# Altium schematic sheet BRAINS.SchDoc: Top Level
size A3; CompanyName: NOT USED; SheetNumber: 0; SheetTotal: 0; PageSetup: Record=PageOptions|CenterHorizontal=True|CenterVertical=True|PrintScale=1.00|XCorrection=1.00|YCorrection=1.00|PrintKind=0|BorderSize=5000000|LeftOffset=0|BottomOffset=0|Orientation=2|PaperLength=1000|PaperWidth=1000|Scale=100|PaperSource=7|PrintQuality=-4|MediaType=1|DitherType=10|PaperKind=A3|PrintScaleMode=0
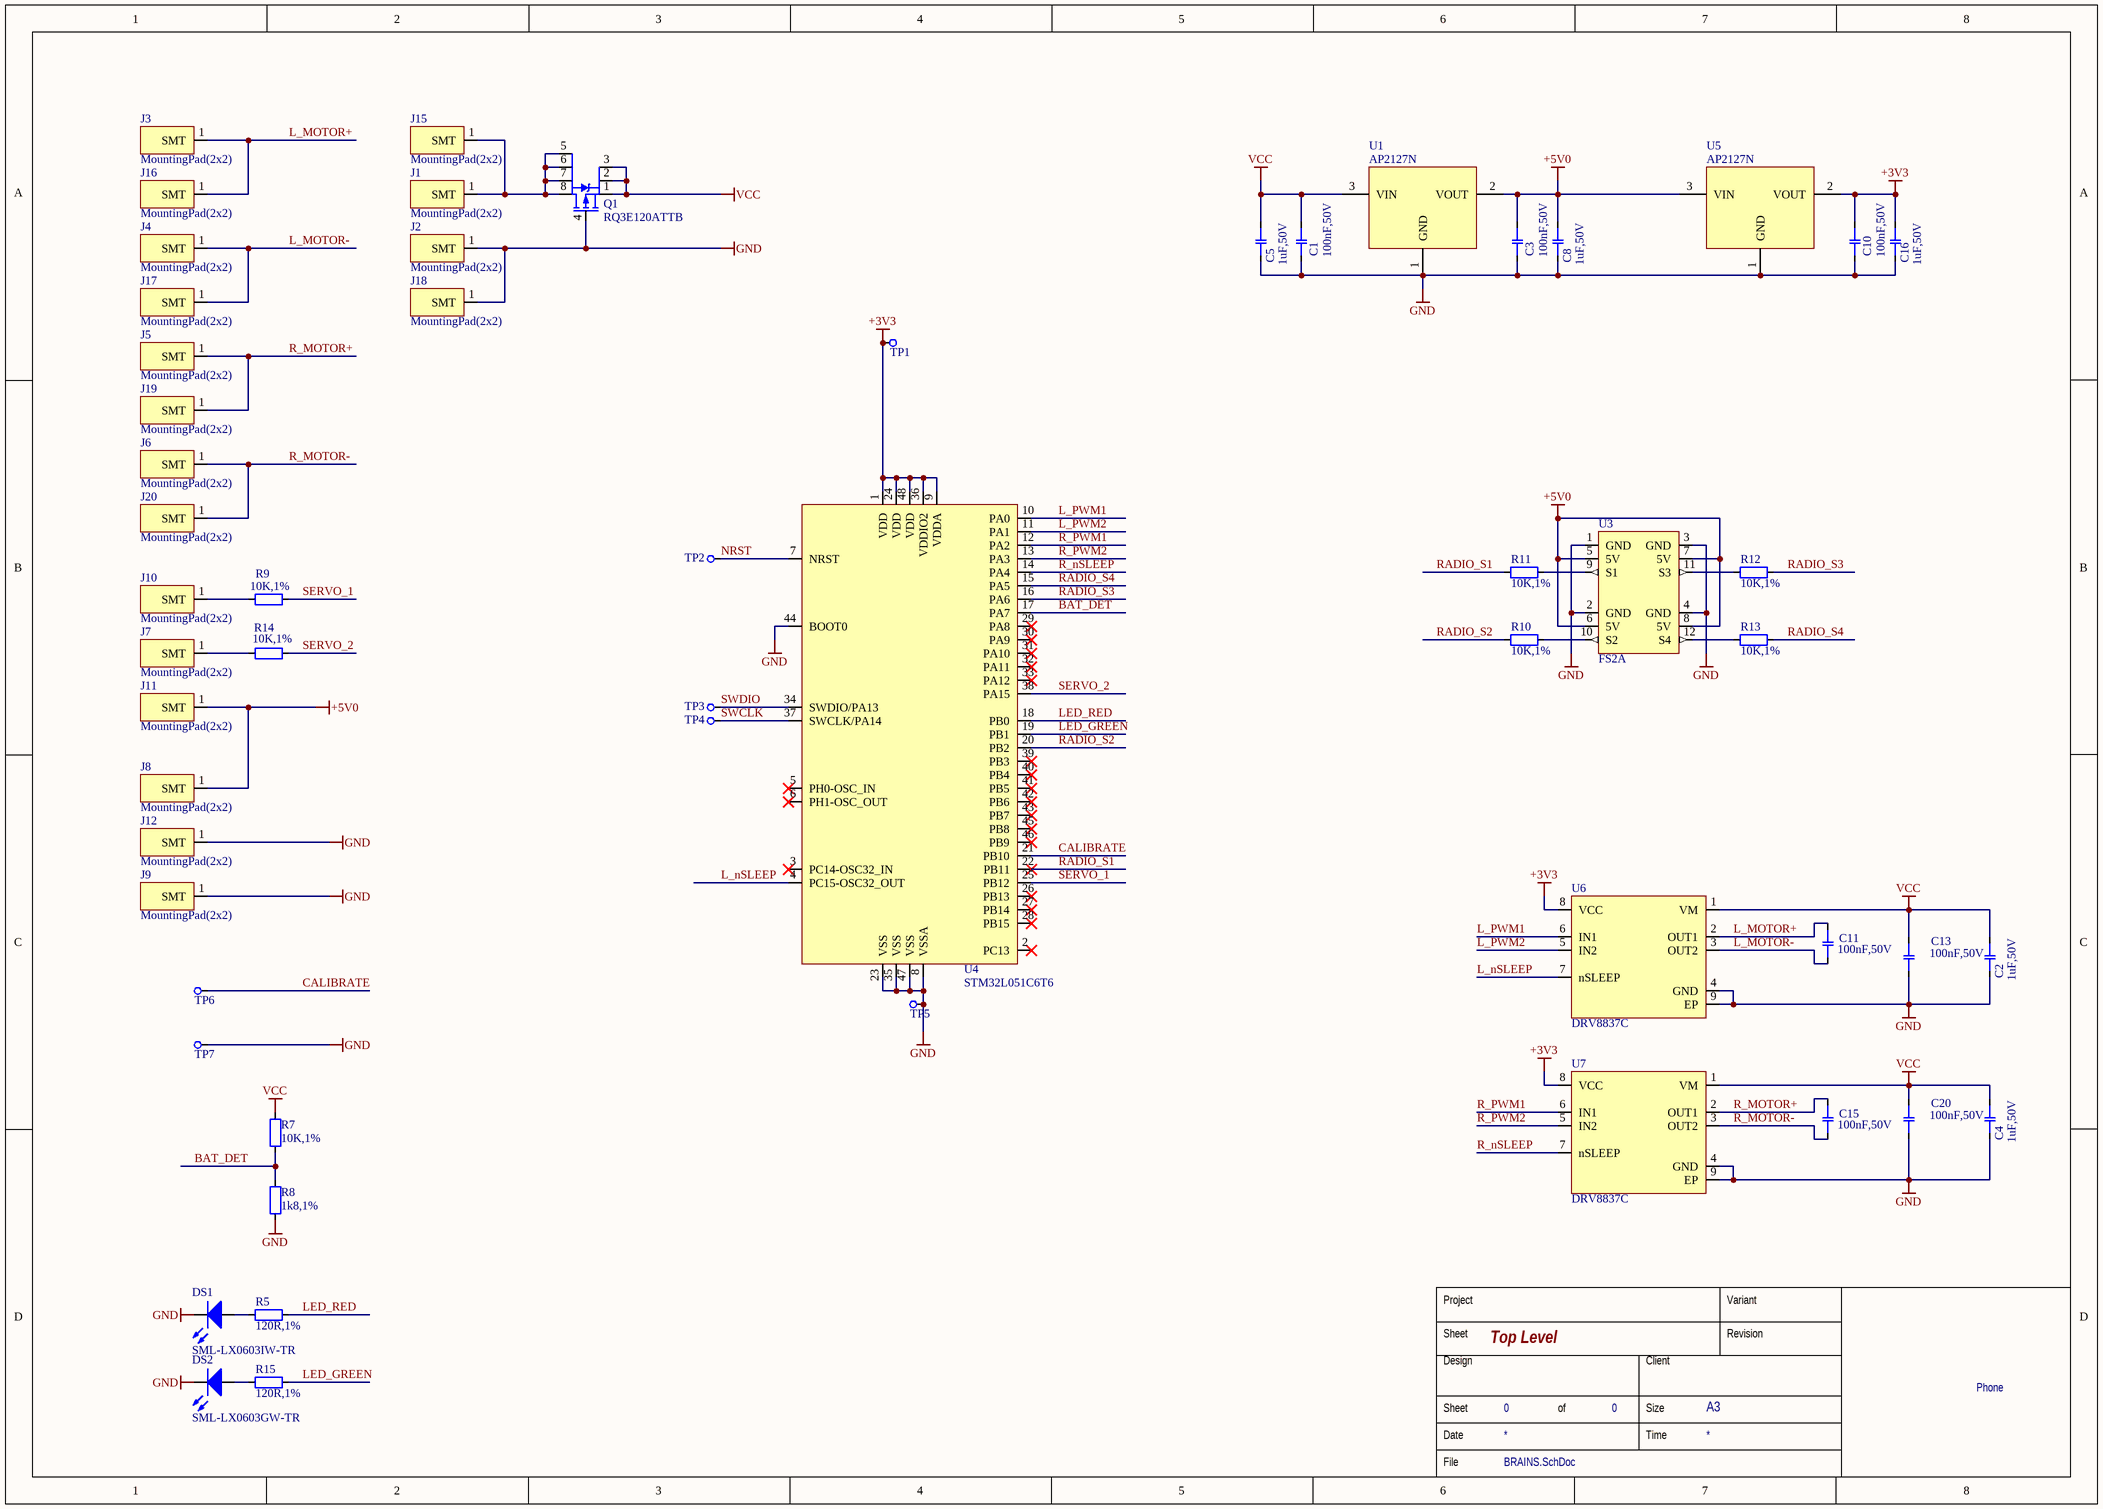
[diagram p0: BRAINS.SchDoc]

## Parts
C1  100nF,50V  [CAPC1005X05N_0402]
C2  1uF,50V  [CAPC1005X05N_0402]
C3  100nF,50V  [CAPC1005X05N_0402]
C4  1uF,50V  [CAPC1005X05N_0402]
C5  1uF,50V  [CAPC1005X05N_0402]
C8  1uF,50V  [CAPC1005X05N_0402]
C10  100nF,50V  [CAPC1005X05N_0402]
C11  100nF,50V  [CAPC1005X05N_0402]
C13  100nF,50V  [CAPC1005X05N_0402]
C15  100nF,50V  [CAPC1005X05N_0402]
C16  1uF,50V  [CAPC1005X05N_0402]
C20  100nF,50V  [CAPC1005X05N_0402]
DS1  SML-LX0603IW-TR  [LED_SML-LX0603]
DS2  SML-LX0603GW-TR  [LED_SML-LX0603]
J1  MountingPad(2x2)  [MountingPad(2x2)]
J2  MountingPad(2x2)  [MountingPad(2x2)]
J3  MountingPad(2x2)  [MountingPad(2x2)]
J4  MountingPad(2x2)  [MountingPad(2x2)]
J5  MountingPad(2x2)  [MountingPad(2x2)]
J6  MountingPad(2x2)  [MountingPad(2x2)]
J7  MountingPad(2x2)  [MountingPad(2x2)]
J8  MountingPad(2x2)  [MountingPad(2x2)]
J9  MountingPad(2x2)  [MountingPad(2x2)]
J10  MountingPad(2x2)  [MountingPad(2x2)]
J11  MountingPad(2x2)  [MountingPad(2x2)]
J12  MountingPad(2x2)  [MountingPad(2x2)]
J15  MountingPad(2x2)  [MountingPad(2x2)]
J16  MountingPad(2x2)  [MountingPad(2x2)]
J17  MountingPad(2x2)  [MountingPad(2x2)]
J18  MountingPad(2x2)  [MountingPad(2x2)]
J19  MountingPad(2x2)  [MountingPad(2x2)]
J20  MountingPad(2x2)  [MountingPad(2x2)]
Q1  RQ3E120ATTB  [ROHM-HSMT8]
R5  120R,1%  [RESC1005X04N_0402]
R7  10K,1%  [RESC1005X04N_0402]
R8  1k8,1%  [RESC1005X04N_0402]
R9  10K,1%  [RESC1005X04N_0402]
R10  10K,1%  [RESC1005X04N_0402]
R11  10K,1%  [RESC1005X04N_0402]
R12  10K,1%  [RESC1005X04N_0402]
R13  10K,1%  [RESC1005X04N_0402]
R14  10K,1%  [RESC1005X04N_0402]
R15  120R,1%  [RESC1005X04N_0402]
TP1  TP_SMT  [TP_100]  (value not drawn)
TP2  TP_SMT  [TP_100]  (value not drawn)
TP3  TP_SMT  [TP_100]  (value not drawn)
TP4  TP_SMT  [TP_100]  (value not drawn)
TP5  TP_SMT  [TP_100]  (value not drawn)
TP6  TP_SMT  [TP_100]  (value not drawn)
TP7  TP_SMT  [TP_100]  (value not drawn)
U1  AP2127N  [SOT95P237X112-3N_SOT23]
U3  FS2A  [FS2A]
U4  STM32L051C6T6  [TSQFP50P900X900X160-48N_48LQFP]
U5  AP2127N  [SOT95P237X112-3N_SOT23]
U6  DRV8837C  [DFN50P200X200X80-8N]
U7  DRV8837C  [DFN50P200X200X80-8N]

## Nets
+3V3: C10.2 C16.2 TP1.1 U4.1(VDD) U4.9(VDDA) U4.24(VDD) U4.36(VDDIO2) U4.48(VDD) U5.2(VOUT) U6.8(VCC) U7.8(VCC)
+5V0: C3.2 C8.2 J8.1(SMT) J11.1(SMT) U1.2(VOUT) U3.5(5V) U3.6(5V) U3.7(5V) U3.8(5V) U5.3(VIN)
GND: C1.1 C2.1 C3.1 C4.1 C5.1 C8.1 C10.1 C13.1 C16.1 C20.1 DS1.1(C) DS2.1(C) J2.1(SMT) J9.1(SMT) J12.1(SMT) J18.1(SMT) Q1.4(G) R8.2 TP5.1 TP7.1 U1.1(GND) U3.1(GND) U3.2(GND) U3.3(GND) U3.4(GND) U4.8(VSSA) U4.23(VSS) U4.35(VSS) U4.44(BOOT0) U4.47(VSS) U5.1(GND) U6.4(GND) U6.9(EP) U7.4(GND) U7.9(EP)
VCC: C1.2 C2.2 C4.2 C5.2 C13.2 C20.2 Q1.1(S) Q1.2(S) Q1.3(S) R7.1 U1.3(VIN) U6.1(VM) U7.1(VM)
BAT_DET: R7.2 R8.1 U4.17(PA7)
CALIBRATE: TP6.1 U4.21(PB10)
L_MOTOR+: C11.2 J3.1(SMT) J16.1(SMT) U6.2(OUT1)
L_MOTOR-: C11.1 J4.1(SMT) J17.1(SMT) U6.3(OUT2)
L_nSLEEP: U4.4(PC15-OSC32_OUT) U6.7(nSLEEP)
L_PWM1: U4.10(PA0) U6.6(IN1)
L_PWM2: U4.11(PA1) U6.5(IN2)
LED_GREEN: R15.2 U4.19(PB1)
LED_RED: R5.2 U4.18(PB0)
NRST: TP2.1 U4.7(NRST)
R_MOTOR+: C15.2 J5.1(SMT) J19.1(SMT) U7.2(OUT1)
R_MOTOR-: C15.1 J6.1(SMT) J20.1(SMT) U7.3(OUT2)
R_nSLEEP: U4.14(PA4) U7.7(nSLEEP)
R_PWM1: U4.12(PA2) U7.6(IN1)
R_PWM2: U4.13(PA3) U7.5(IN2)
RADIO_S1: R11.1 U4.22(PB11)
RADIO_S2: R10.1 U4.20(PB2)
RADIO_S3: R12.2 U4.16(PA6)
RADIO_S4: R13.2 U4.15(PA5)
SERVO_1: R9.1 U4.25(PB12)
SERVO_2: R14.1 U4.38(PA15)
SWCLK: TP4.1 U4.37(SWCLK/PA14)
SWDIO: TP3.1 U4.34(SWDIO/PA13)
NetDS1_2: DS1.2(A) R5.1
NetDS2_2: DS2.2(A) R15.1
NetJ1_1: J1.1(SMT) J15.1(SMT) Q1.5(D) Q1.6(D) Q1.7(D) Q1.8(D)
NetJ7_1: J7.1(SMT) R14.2
NetJ10_1: J10.1(SMT) R9.2
NetR10_2: R10.2 U3.10(S2)
NetR11_2: R11.2 U3.9(S1)
NetR12_1: R12.1 U3.11(S3)
NetR13_1: R13.1 U3.12(S4)

Not connected (* = marked no-connect by the designer): U4 2(PC13)* 3(PC14-OSC32_IN)* 5(PH0-OSC_IN)* 6(PH1-OSC_OUT)* 26(PB13)* 27(PB14)* 28(PB15)* 29(PA8)* 30(PA9)* 31(PA10)* 32(PA11)* 33(PA12)* 39(PB3)* 40(PB4)* 41(PB5)* 42(PB6)* 43(PB7)* 45(PB8)* 46(PB9)*

## Notes on the sheet
- Project
- Variant
- Sheet
- Design
- Client
- Revision
- Phone
- Date
- of
- Size
- Time
- A3
- File

## Library data of the parts
C1 C3 C10 C11 C13 C15 C20 = CCG-104CE-G: CAP CER 100nF 50V X7R 0402; Manufacturer: Taiyo Yuden; Manufacturer Part Number: UMK105B7104KV-FR; Tolerance: 10%; Type: Ceramic; Display_Name: 100nF,50V; Capacitance: 100nF; Dielectric: X7R; Voltage: 50V; BWA PN: CCG-104CE-G; Schematic Symbol: CAP-NP_1; Supplier 1: Digi-Key; Supplier Part Number 1: 587-3498-1-ND
C2 C4 C5 C8 C16 = CCG-106DH-H: CAP CER 1UF 50V X5R 0402; Manufacturer: Taiyo Yuden; Manufacturer Part Number: UMK105CBJ105MV-F; Tolerance: 20%; Type: Ceramic; Display_Name: 1uF,50V; Capacitance: 1uF; Dielectric: X5R; Voltage: 50V; BWA PN: CCG-106DH-H; Schematic Symbol: CAP-NP_1; Supplier 1: Digi-Key; Supplier Part Number 1: 587-6278-1-ND
DS1 = LED-10056-A: LED 635NM RED DIFF 0603 SMD; Manufacturer: Lumex Opto/Components Inc; Axial Intensity: 14mcd; If(max): 20mA; Lens type: Diffused, White; Lens Style/Size: Rectangle, 1mmx0.8mm; Vf@I: 2V; Viewing Angle: 160deg; Vr(max): 5V; Display_Name: SML-LX0603IW-TR; Wavelength: 635nm; BWA PN: LED-10056-A; Colour: Red; Schematic Symbol: LED_1; Manufacturer Part Number: SML-LX0603IW-TR; Supplier 1: Digi-Key; Supplier Part Number 1: 67-1548-1-ND
DS2 = LED-10011-A: LED 565NM GRN DIFF 0603 SMD; Manufacturer: Lumex Opto/Components Inc; Axial Intensity: 18mcd; Colour: Green; If(max): 25mA; Lens type: Diffused, White; Lens Style/Size: Rectangle, 1mmx0.8mm; Vf@I: 2.2V; Viewing Angle: 160deg; Vr(max): 5V; Display_Name: SML-LX0603GW-TR; Wavelength: 565nm; BWA PN: LED-10011-A; Schematic Symbol: LED_1; Manufacturer Part Number: SML-LX0603GW-TR; Supplier 1: Digi-Key; Supplier Part Number 1: 67-1549-1-ND
Q1 = TRN-10125-A: MOSFET P-CH 30V 12A 8HSMT; Manufacturer: Rohm Semiconductor; Type: P; Id(max): 12A (Ta); rds(on): 8mOhm @ 12A, 10V; Vgs(max): ±20V / ±20V / ±20V; Vth(max): 2.5V @ 1mA; Display_Name: RQ3E120ATTB; BWA PN: TRN-10125-A; Vds(max): 30V; Schematic Symbol: MOSFET-P_5; Manufacturer Part Number: RQ3E120ATTB; Supplier 1: Digi-Key; Supplier Part Number 1: RQ3E120ATTBCT-ND
R5 R15 = RSG-120R0-D: RES 120 OHM 1/16W 0402 SMD; Manufacturer: Yageo; Manufacturer Part Number: RC0402FR-07120RL; Power: 0.0625W; Display_Name: 120R,1%; Resistance: 120R; Tolerance: 1%; Type: Chip; BWA PN: RSG-120R0-D; Schematic Symbol: RESISTOR_1; Supplier 1: Digi-Key; Supplier Part Number 1: 311-120LRCT-ND
R7 R9-R14 = RSG-10K00-D: RES 10K OHM 1/16W 1% 0402 SMD; Manufacturer: Yageo; Manufacturer Part Number: RC0402FR-0710KL; Power: 0.0625W; Display_Name: 10K,1%; Resistance: 10K; Tolerance: 1%; Type: Chip; BWA PN: RSG-10K00-D; Schematic Symbol: RESISTOR_1; Supplier 1: Digi-Key; Supplier Part Number 1: 311-10.0KLRCT-ND
R8 = RSG-1K800-D: RES 1k8 0.0625W 1% 0402 SMD; Manufacturer: Vishay Dale; Manufacturer Part Number: CRCW04021K80FKED; Display_Name: 1k8,1%; Power: 0.0625W; Resistance: 1k8; Tolerance: 1%; Type: Chip; BWA PN: RSG-1K800-D; Schematic Symbol: RESISTOR_1; Supplier 1: Digi-Key; Supplier Part Number 1: 541-1.80KLCT-ND
TP1-TP7 = NONPART-002: Test Point - SMT; Display_Name: TP_SMT; BWA PN: NONPART-002; Schematic Symbol: TP_1
U1 U5 = ICT-10968-A: IC REG LINEAR 3.3V 300MA SOT23; Manufacturer: Diodes Incorporated; Temp Range: -40°C ~ 85°C; Display_Name: AP2127N; BWA PN: ICT-10968-A; Schematic Symbol: AP2127N-3.3TRG1; Manufacturer Part Number: AP2127N-3.3TRG1; Supplier 1: Digi-Key; Supplier Part Number 1: AP2127N-3.3TRG1DICT-ND
U4 = ICT-10938-A: IC MCU 32BIT 32KB FLASH 48LQFP; Manufacturer: STMicroelectronics; Temp Range: -40°C ~ 85°C (TA); Schematic Symbol: STM32L051C6T6_48LQFP; Display_Name: STM32L051C6T6; BWA PN: ICT-10938-A; Manufacturer Part Number: STM32L051C6T6; Supplier 1: Digi-Key; Supplier Part Number 1: 497-15202-ND
U6 U7 = ICT-10892-A: IC HALF-BRIDGE DRVR PWM 8WSON; Manufacturer: Texas Instruments; Manufacturer Part Number: DRV8837CDSGR; Temp Range: -40°C ~ 85°C; Display_Name: DRV8837C; BWA PN: ICT-10892-A; Schematic Symbol: DRV8837C; Supplier 1: Digi-Key; Supplier Part Number 1: 296-47205-1-ND